# Altium schematic sheet Back.SchDoc
size A3
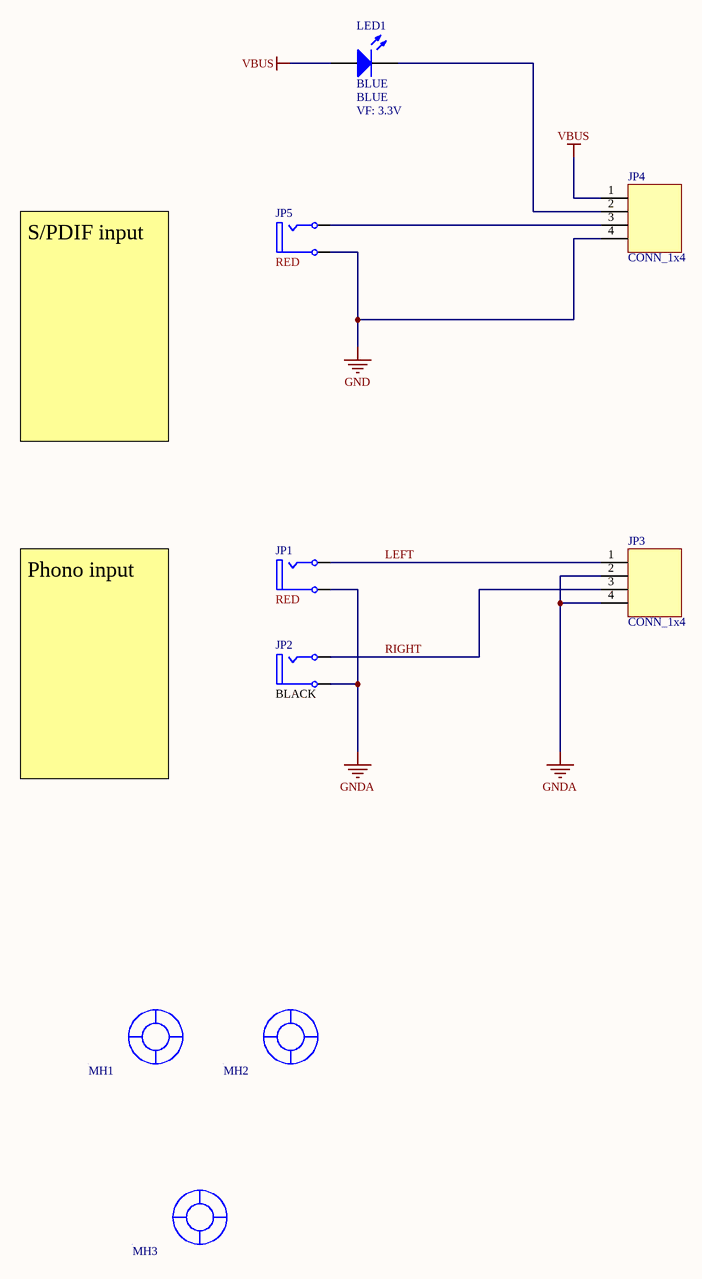
[diagram p0: Back.SchDoc]

## Parts
JP1  value RED  [CONN_RCA-Lumberg-BTOR]  (hidden comment: RCA RED)
JP2  value BLACK  [CONN_RCA-Lumberg-BTOR]  (hidden comment: RCA BLACK)
JP3  CONN_1x4  [CONN_HDR1X4-No3D]
JP4  CONN_1x4  [CONN_HDR1X4-No3D]
JP5  value RED  [CONN_RCA-Lumberg-BTOR]  (hidden comment: RCA RED)
LED1  BLUE  VF: 3.3V  [LED-KPTL-3216QBC]
MH1  Mounting hole  [MECH_MHOLE_3.5-GND]  (value not drawn)  (no BOM)
MH2  Mounting hole  [MECH_MHOLE_3.5]  (value not drawn)  (no BOM)
MH3  Mounting hole  [MECH_USB_MICRO_CUTOUT]  (value not drawn)  (no BOM)

## Nets
GND: JP4.4 JP5.2(Ground)
GNDA: JP1.2(Ground) JP2.2(Ground) JP3.2 JP3.4
VBUS: JP4.1 LED1.A
LEFT: JP1.1(Signal) JP3.1
RIGHT: JP2.1(Signal) JP3.3
NetJP4_2: JP4.2 LED1.K
NetJP4_3: JP4.3 JP5.1(Signal)

## Notes on the sheet
- S/PDIF input
- Phono input

## Library data of the parts
JP1 JP5 = CONN_RCA_LUMBERG_BTOR_1_RED: RCA panel-mount socket red, 1553 02 rot, Lumberg Connect GmbH; MPN: BTOR 1 ROT; ELFA: 300-68-470
  JP1: Farnell: 1368644
JP2 = CONN_RCA_LUMBERG_BTOR_1_BLACK: RCA panel-mount socket red, 1553 02 rot, Lumberg Connect GmbH; MPN: BTOR 1 SCHWARZ; ELFA: 300-68-471; Farnell: 1217030
JP3 JP4 = CONN_MHDR_1x4: Header, 4-Pin; MPN: 0470531000; LatestRevisionDate: 17-Jul-2002; LatestRevisionNote: Re-released for DXP Platform.; Publisher: Altium Limited; DigiKey: WM4330-ND
LED1 = LED-BLUE-KPTL-3216QBC-D-01: LED BLUE; MPN: KPTL-3216QBC-D-01; Farnell: 2217907; VALUE: BLUE
MH1 MH2 = MECH_MHOLE
MH3 = MECH_MICRO_B_CUTOUT